# EAGLE design fzduino (EAGLE 5.11)
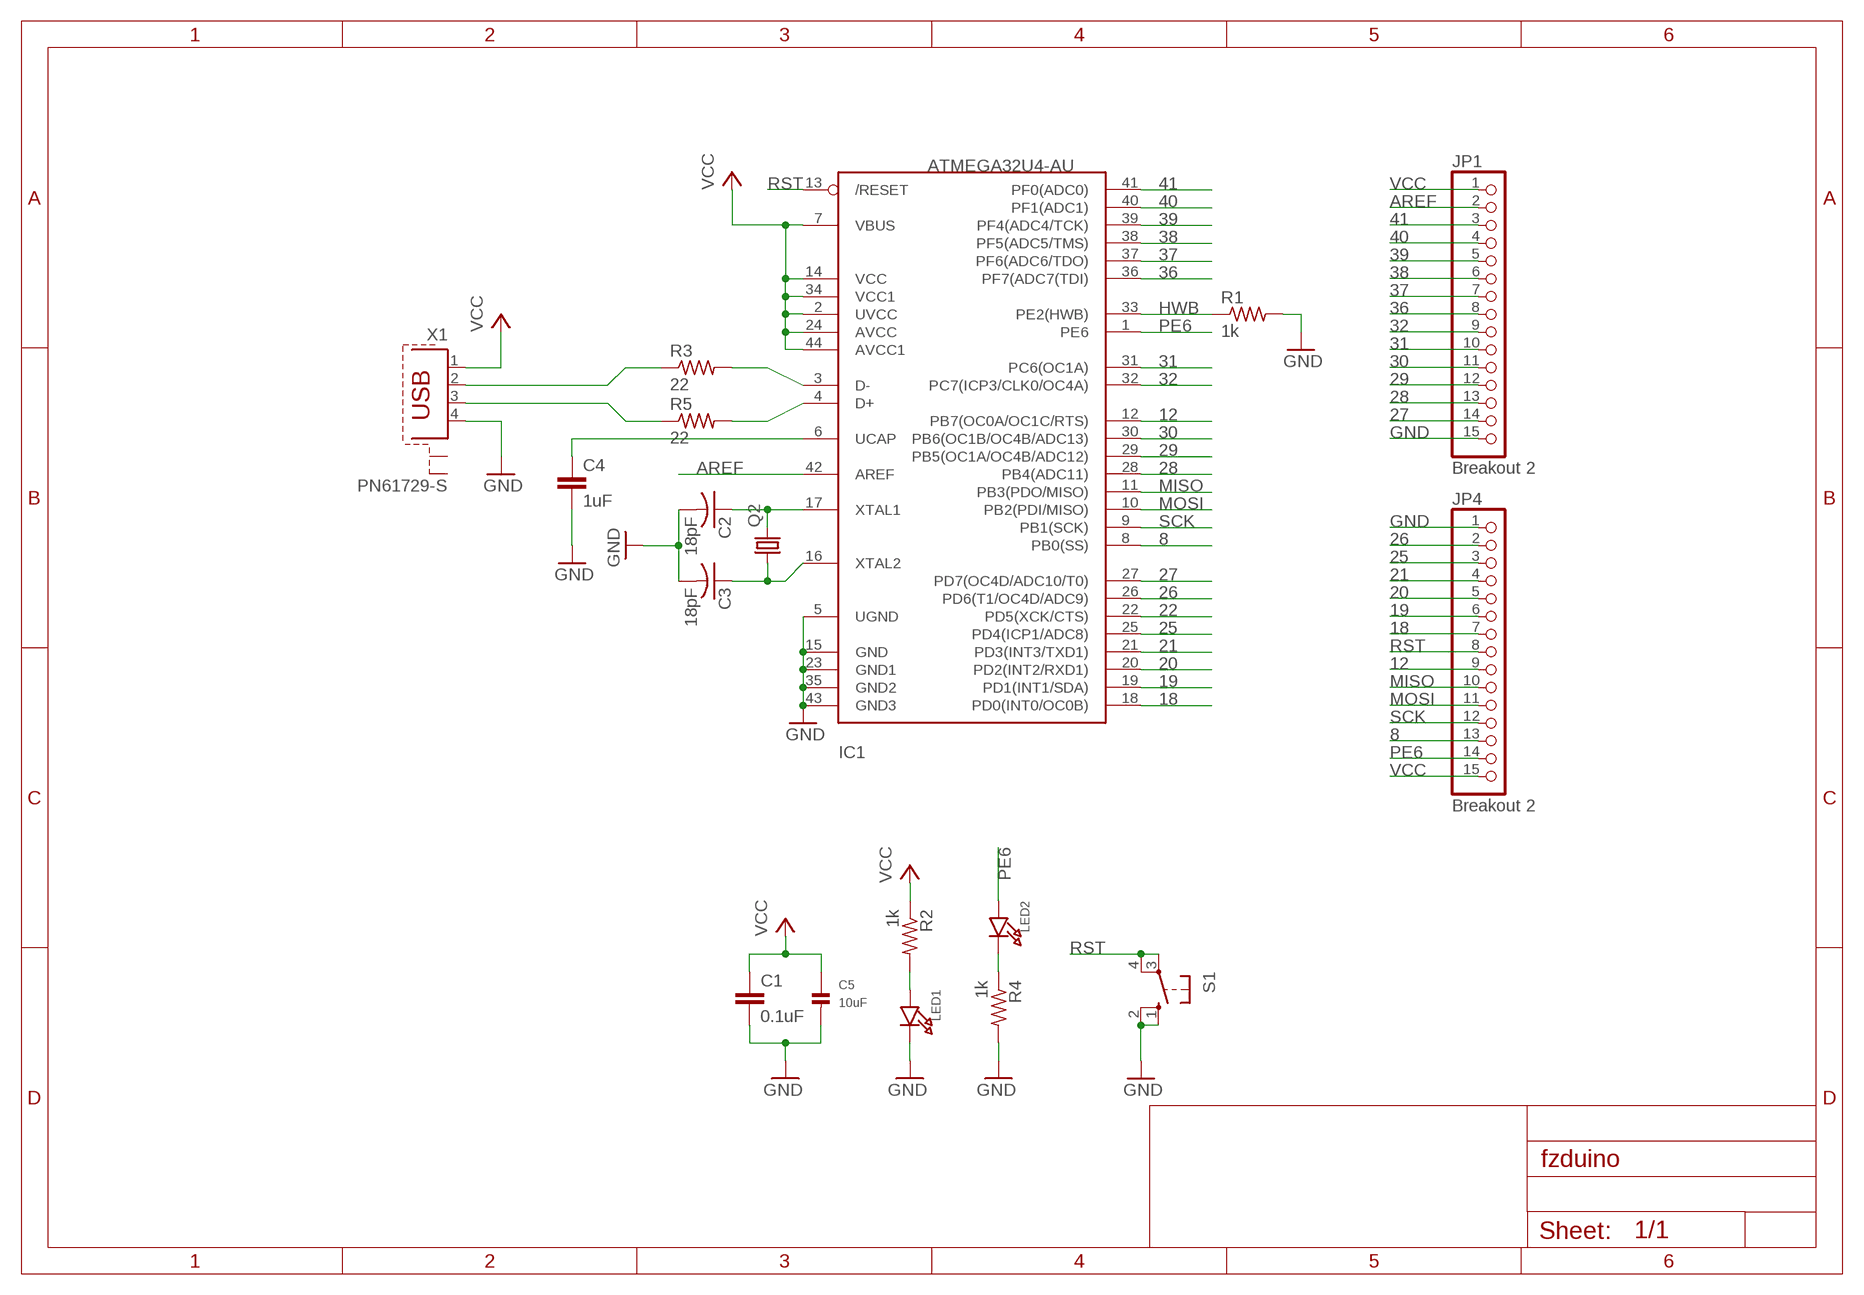
[diagram p0: schematic, sheet 1]

## Parts
C1  0.1uF  C-EUC0805  [C0805]
C2  18pF  C-USC0805K  [C0805K]
C3  18pF  C-USC0805K  [C0805K]
C4  1uF  C-EUC0805  [C0805]
C5  10uF  CAP_CERAMIC1206  [1206]
IC1  ATMEGA32U4-AU  [TQFP44]
JP1  Breakout 2  PINHD-1X15-CB  [1X15-CB]
JP4  Breakout 2  PINHD-1X15-CB  [1X15-CB]
LED1  LED1206  [CHIPLED_1206]
LED2  LED1206  [CHIPLED_1206]
Q2  CRYSTALHC49S  [HC49/S]
R1  1k  R-US_M1206  [M1206]
R2  1k  R-US_M1206  [M1206]
R3  22  R-US_M1206  [M1206]
R4  1k  R-US_M1206  [M1206]
R5  22  R-US_M1206  [M1206]
S1  10-XX  [B3F-10XX]
X1  PN61729-S  [PN61729-S]

## Nets
8: IC1.8(PB0(SS)) JP4.13
12: IC1.12(PB7(OC0A/OC1C/RTS)) JP4.9
18: IC1.18(PD0(INT0/OC0B)) JP4.7
19: IC1.19(PD1(INT1/SDA)) JP4.6
20: IC1.20(PD2(INT2/RXD1)) JP4.5
21: IC1.21(PD3(INT3/TXD1)) JP4.4
22: IC1.22(PD5(XCK/CTS))
25: IC1.25(PD4(ICP1/ADC8)) JP4.3
26: IC1.26(PD6(T1/OC4D/ADC9)) JP4.2
27: IC1.27(PD7(OC4D/ADC10/T0)) JP1.14
28: IC1.28(PB4(ADC11)) JP1.13
29: IC1.29(PB5(OC1A/OC4B/ADC12)) JP1.12
30: IC1.30(PB6(OC1B/OC4B/ADC13)) JP1.11
31: IC1.31(PC6(OC1A)) JP1.10
32: IC1.32(PC7(ICP3/CLK0/OC4A)) JP1.9
36: IC1.36(PF7(ADC7(TDI)) JP1.8
37: IC1.37(PF6(ADC6/TDO)) JP1.7
38: IC1.38(PF5(ADC5/TMS)) JP1.6
39: IC1.39(PF4(ADC4/TCK)) JP1.5
40: IC1.40(PF1(ADC1)) JP1.4
41: IC1.41(PF0(ADC0)) JP1.3
AREF: IC1.42(AREF) JP1.2
GND: C1.2 C2.2 C3.2 C4.2 C5.2 IC1.5(UGND) IC1.15(GND) IC1.23(GND1) IC1.35(GND2) IC1.43(GND3) JP1.15 JP4.1 LED1.C R1.2 R4.2 S1.1(S) S1.2(S1) X1.4
HWB: IC1.33(PE2(HWB)) R1.1
MISO: IC1.11(PB3(PDO/MISO)) JP4.10
MOSI: IC1.10(PB2(PDI/MISO)) JP4.11
N$1: LED1.A R2.2
N$2: R5.1 X1.3
N$3: IC1.3(D-) R3.2
N$4: IC1.4(D+) R5.2
N$5: R3.1 X1.2
N$6: LED2.C R4.1
N$8: C2.1 IC1.17(XTAL1) Q2.2
N$9: C3.1 IC1.16(XTAL2) Q2.1
N$10: C4.1 IC1.6(UCAP)
PE6: IC1.1(PE6) JP4.14 LED2.A
RST: IC1.13(/RESET) JP4.8 S1.3(P) S1.4(P1)
SCK: IC1.9(PB1(SCK)) JP4.12
VCC: C1.1 C5.1 IC1.2(UVCC) IC1.7(VBUS) IC1.14(VCC) IC1.24(AVCC) IC1.34(VCC1) IC1.44(AVCC1) JP1.1 JP4.15 R2.1 X1.1
Unconnected: X1.S1 X1.S2

## Library data of the parts
C1 C4 = rcl:C-EU: CAPACITOR, European symbol
C2 C3 = adafruit:C-US: CAPACITOR, American symbol
C5 = microbuilder:CAP_CERAMIC: Ceramic Capacitors 0402 - 0402 Surface Mount Capacitors 16pF 50V 5% [Digikey: 445-4899-2-ND] 18pF 50V 5% [Digikey: 490-1281-2-ND] 22pF 50V 5% [Digikey: 490-1283-2-ND] 68pF 50V 5% [Digikey: 490-1289-2-ND] 0.1uF 10V 10% [Digikey: 490-1318-2-ND] 1.0uF 6.3V 10% [Digikey: 490-1320-2-ND] 0603 - 0603 Surface Mount Capacitors 16 pF 50V 5% [Digikey: 445-5051-2-ND] 22 pF 50V [Digikey: PCC220ACVTR-ND] 33 pF 50V 5% [Digikey: 490-1415-1-ND] 56pF 50V 5% [Digikey: 490-1421-1-ND] 220pF 50V 5% [Digikey: 445-1285-1-ND] 680 pF 50V 2200 pF 50V 5% C0G [Digikey: 445-1297-1-ND] 5600 pF 100V 5% X7R [Digikey: 478-3711-1-ND] 0.1 µF 25V 10% [Digikey: PCC2277TR-ND] 0.22 µF 16V 10% X7R [Digikey: 445-1318-1-ND] 1.0 µF 25V 10% [Digikey: 445-5146-2-ND] 0603 - RF Specific 3pF 250V +/-0.1pF RF [Digikey: 712-1347-1-ND] 18 pF 250V 5% [Digikey: 478-3505-1-ND or 712-1322-1-ND] 56 pF 250V 5% C0G RF [Digikey: 490-4867-1-ND] 68 pF 250V RF [Digikey: 490-4868-1-ND] 0805 - 0805 Surface Mount Capacitors 220 pF 250V 2% RF Ceramic Capacitor [Digikey: 712-1398-1-ND] 1000 pF 50V 2% NP0 Ceramic Capacitor [Digikey: 478-3760-1-ND] 0.1 µF 25V 10% Ceramic Capacitor [Digikey: PCC1828TR-ND] 1.0 µF 16V 10% Ceramic Capacitor[Digikey: 490-1691-2-ND] 10.0 µF 10V 10% Ceramic Capacitor[Digikey: 709-1228-1-ND] 10.0 uF 16V 10% Ceramic Capacitor [Digikey: 478-5165-2-ND] 47 uF 6.3V 20% Ceramic Capacitor [Digikey: 587-1779-1-ND or 399-5506-1-ND] 1206 - 1206 Surface Mount Capacitors 47uF 10V 20% Ceramic Capacitor [Digikey: 490-5528-1-ND or 399-5508-1-ND or 445-6010-1-ND]
IC1 = adaprog:ATMEGA32U4
JP1 JP4 = adafruit:PINHD-1X15: PIN HEADER
LED1 LED2 = microbuilder:LED: LED 0603 - 0603 Surface Mount Package 2mA: Green LED - Low Power (3.9mcd, 2ma, 1.7Vf) - Digikey: 475-2709-2-ND Orange LED - Low Power (9.8mcd, 2ma, 1.8Vf) - Digikey: 475-1194-2-ND Red LED - Low Power (5mcd, 2ma, 1.8Vf) - Digikey: 475-1195-2-ND Yellow LED - Low Power (7mcd, 2ma, 1.8Vf) - Digikey: 475-1196-2-ND 5mA: Blue LED - Low Power (17mcd, 5ma, 2.9Vf) - Digikey: LNJ937W8CRACT-ND 0805 - 0805 Surface Mount Package 2mA: Red LED (8.8mcd, 2mA, 1.8Vf, Clear) - Low Power [Digikey: 475-2510-1-ND] Green LED (5mcd, 2mA, 1.8Vf, Clear) - Low Power [Digikey: 475-2730-1-ND] Yellow LED (11.3mcd, 2mA, 1.8Vf, Clear) - Low Power [Digikey: 475-2555-1-ND] 20mA: Red LED (104mcd, 20mA, Diffused) - LS R976 [Digikey: 475-1278-6-ND] Red LED (12mcd, 20mA, 2.0Vf, Clear) - APT2012EC [Digikey: 754-1128-1-ND] Green LED (15mcd, 20mA, 2.2Vf, Clear) - APT2012GC [Digikey: 754-1131-1-ND] Orange LED (160mcd, 20mA, 2.1Vf, Clear) - APT2012SECK [Digikey: 754-1130-1-ND] 1206 - 1206 Surface Mount Package Green LED (26mcd, 20mA, Diffused) - LG N971 [Digikey: 475-1407-6-ND] Red LED (15mcd, 20mA, Diffused) - LH N974 [Digikey: 475-1416-6-ND]
Q2 = crystal:CRYSTAL: CRYSTAL; OC_FARNELL: 1667008; OC_NEWARK: unknown
R1-R5 = rcl:R-US_: RESISTOR, American symbol
S1 = switch-omron:10-XX: OMRON SWITCH; MPN: B3F-1000; OC_FARNELL: 176432; OC_NEWARK: 36M3542
X1 = con-berg:PN61729-S: BERG USB connector; OC_FARNELL: unknown; OC_NEWARK: unknown

## Board
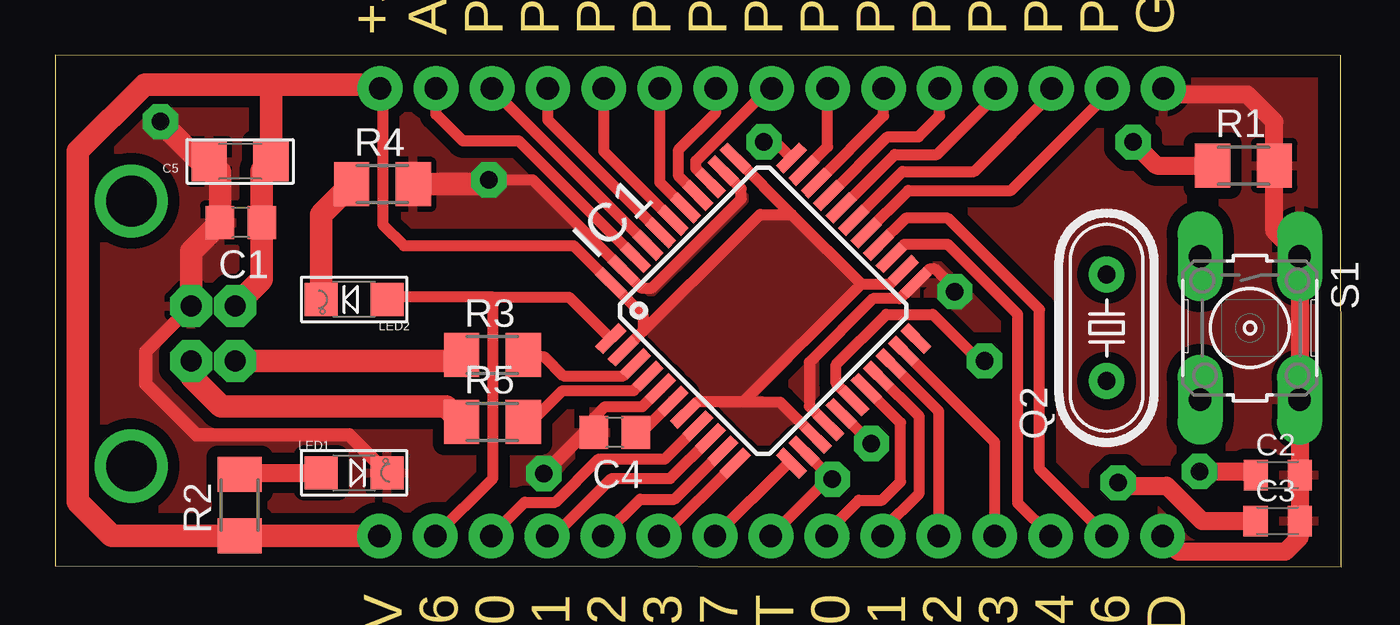
[diagram p1: board, top side]
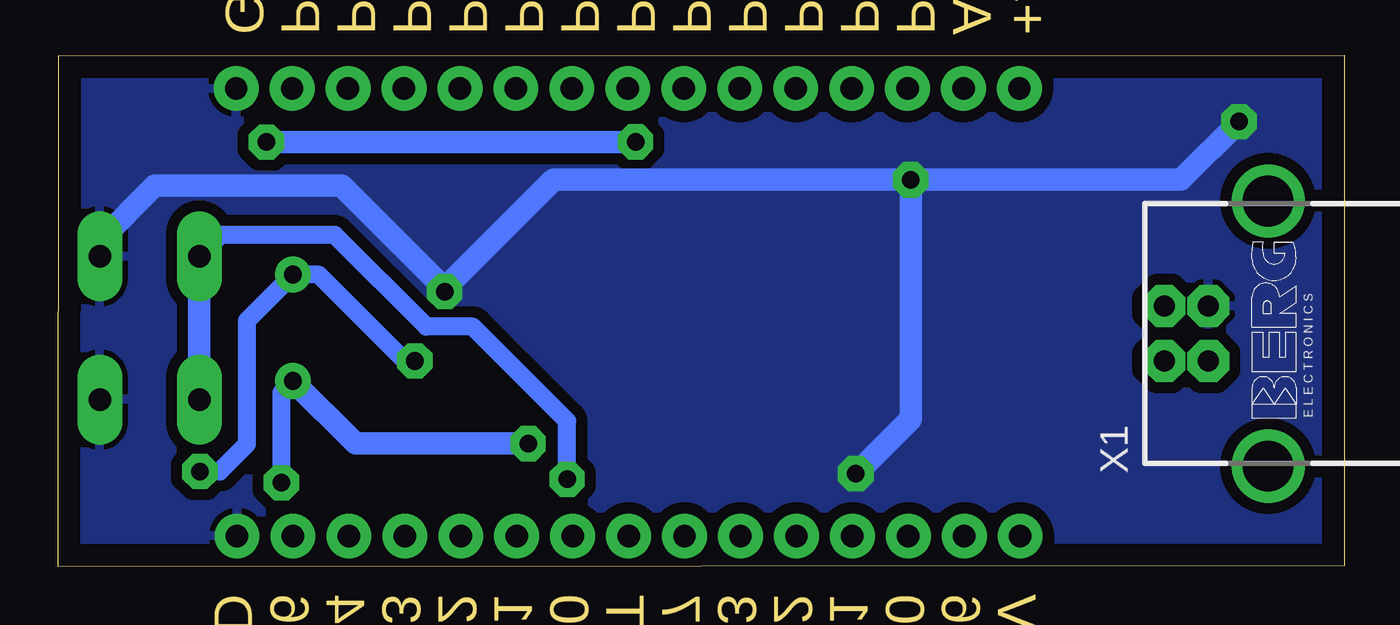
[diagram p2: board, bottom side, seen from below]

Size 58.39 x 23.25 mm. Coordinates in mm from the lower left corner, seen from the top.
Outline: 0,0.06 58.39,0 58.38,23.22 0.02,23.25 0,0.06
Copper layers (1*16): Top 0.035mm / dielectric 1.5mm / Bottom 0.035mm
Design rules "default *": minimum track width 10mil, minimum drill 24mil, track to track 20mil, track to pad 20mil, pad to pad 20mil, via to via 20mil, smd to smd 20mil, copper to edge 40mil, drill to drill 8mil, minimum pad ring 10mil, minimum via ring 8mil, stop-mask expansion 4mil, vias tented up to drill 0mil, thermal gap 10mil

### Footprints (pad centres in the part's own frame; a part is rotated, then mirrored left to right if it is on the bottom)
C0805 = smd 1.3 x 1.5: 1 -0.95,0; 2 0.95,0
C0805K = smd 1.1 x 1.4: 1 -1,0; 2 1,0
1206 = smd 1.6 x 1.8: 1 -1.4,0; 2 1.4,0
TQFP44 = smd 1.5 x 0.5: 1 -5.8,4; 2 -5.8,3.2; 3 -5.8,2.4; 4 -5.8,1.6; 5 -5.8,0.8; 6 -5.8,0; 7 -5.8,-0.8; 8 -5.8,-1.6; 9 -5.8,-2.4; 10 -5.8,-3.2; 11 -5.8,-4; 23 5.8,-4; 24 5.8,-3.2; 25 5.8,-2.4; 26 5.8,-1.6; 27 5.8,-0.8; 28 5.8,0; 29 5.8,0.8; 30 5.8,1.6; 31 5.8,2.4; 32 5.8,3.2; 33 5.8,4 | smd 0.5 x 1.5: 12 -4,-5.8; 13 -3.2,-5.8; 14 -2.4,-5.8; 15 -1.6,-5.8; 16 -0.8,-5.8; 17 0,-5.8; 18 0.8,-5.8; 19 1.6,-5.8; 20 2.4,-5.8; 21 3.2,-5.8; 22 4,-5.8; 34 4,5.8; 35 3.2,5.8; 36 2.4,5.8; 37 1.6,5.8; 38 0.8,5.8; 39 0,5.8; 40 -0.8,5.8; 41 -1.6,5.8; 42 -2.4,5.8; 43 -3.2,5.8; 44 -4,5.8
1X15-CB = drill 1.016 pad 1.778 round: 1 -17.78,0; 2 -15.24,0; 3 -12.7,0; 4 -10.16,0; 5 -7.62,0; 6 -5.08,0; 7 -2.54,0; 8 0,0; 9 2.54,0; 10 5.08,0; 11 7.62,0; 12 10.16,0; 13 12.7,0; 14 15.24,0; 15 17.78,0
CHIPLED_1206 = smd 1.5 x 1.5: A 0,-1.496; C 0,1.496
HC49/S = drill 0.813 round: 1 -2.413,0; 2 2.413,0
M1206 = smd 1.6 x 2: 1 -1.4,0; 2 1.4,0
B3F-10XX = drill 1.016 long: 1 -3.251,2.261; 2 3.251,2.261; 3 -3.251,-2.261; 4 3.251,-2.261
PN61729-S = drill 0.95 octagon: 1 1.25,4.71; 2 -1.25,4.71; 3 -1.25,2.71; 4 1.25,2.71 | drill 2.3 pad 2.9 round: S1 -6.02,0; S2 6.02,0

### Placement (x,y rotation side)
C1  8.44,15.64 180 top
C2  55.51,4.17 0 top
C3  55.5,2.08 0 top
C4  25.42,6.11 180 top
C5  8.4,18.42 180 top
IC1  32.16,11.64 45 top
JP1  32.53,21.73 0 top
JP4  32.5,1.4 180 top
LED1  13.58,4.27 270 top
LED2  13.58,12.15 90 top
Q2  47.74,10.86 90 top
R1  53.96,18.23 0 top
R2  8.38,2.81 90 top
R3  19.86,9.62 0 top
R4  14.86,17.39 0 top
R5  19.86,6.59 0 top
S1  54.24,10.85 270 top
X1  3.46,10.6 90 bottom

### Tracks (layer width: path | path; a pad name or v marks a point on that pad's centre or on a via)
8
  Top 0.508: IC1.8 27.68,4.91 24.68,4.91 22.71,2.94 21.32,2.94 19.8,1.42 JP4.13
12
  Top 0.508: IC1.12 33.27,4.71 JP4.9
18
  Top 0.508: IC1.18 38.39,6.54 38.39,3.87 37.54,3.03 36.49,3.03 35.04,1.57 JP4.7
19
  Top 0.508: IC1.19 39.23,6.83 39.23,3.35 37.58,1.7 JP4.6
20
  Top 0.508: IC1.20 40.12,7.07 JP4.5
21
  Top 0.508: IC1.21 42.66,5.66 JP4.4
25
  Top 0.508: IC1.25 38.56,14.65 40.53,14.65 43.71,11.47 43.71,2.9 JP4.3
26
  Top 0.508: IC1.26 38.62,15.84 40.53,15.84 44.69,11.68 44.69,4.45 JP4.2
27
  Top 0.508: IC1.27 38.74,17.09 43.4,17.09 47.77,21.46 JP1.14
28
  Top 0.508: IC1.28 38.48,17.97 41.74,17.97 45.23,21.46 JP1.13
29
  Top 0.508: IC1.29 38.12,18.74 40.04,18.74 42.69,21.39 JP1.12
30
  Top 0.508: IC1.30 37.79,19.54 39.21,19.54 40.15,20.49 JP1.11
31
  Top 0.508: IC1.31 37.61,20.49 JP1.10
32
  Top 0.508: IC1.32 35.07,19.09 JP1.9
36
  Top 0.508: IC1.36 29.09,18.1 29.09,18.44 32.38,21.73 JP1.8
37
  Top 0.508: IC1.37 28.31,17.75 28.31,18.96 29.99,20.64 JP1.7
38
  Top 0.508: IC1.38 27.45,17.48 JP1.6
39
  Top 0.508: IC1.39 24.91,18.88 24.91,18.89 JP1.5
40
  Top 0.508: IC1.40 22.37,20.29 22.37,20.3 JP1.4
41
  Top 0.508: IC1.41 19.83,21.7 JP1.3
AREF
  Top 0.508: IC1.42 21.06,19.34 18.52,19.34 17.29,20.56 JP1.2
GND  (via drill 0.8)
  Top 0.508: IC1.35 31.14,17.18 31.14,16.71 27.11,12.68 26.59,12.68 IC1.43 21.69,17.58 v19.69,17.58 | IC1.15 34.24,7.29 34.24,9.29 37.13,12.18 38.36,12.18 IC1.23 39.69,13.52 39.96,13.52 40.85,12.63 v40.85,12.5 | IC1.5 26.66,7.28 24.97,7.28 24.47,6.77 C4.2
  Top 0.61: C4.2 24.06,6.11 v22.19,4.23 | LED1.C 13.35,6 6.43,6 4.11,8.31 4.11,9.79 X1.4
  Top 0.813: JP4.1 50.99,0.69 55.86,0.69 56.5,1.34 C3.2 C2.2 S1.2 S1.1 55.36,15.25 R1.2 55.36,20.22 54.11,21.46 50.58,21.46 JP1.15
  Top 1.016: 5.97,11.85 X1.4 6.17,14.33 C1.2 7.49,17.93 | v19.69,17.58 19.49,17.39 R4.2 | 7.49,17.93 C5.2 | 7.49,17.93 7.08,17.93 v4.78,20.23
  Bottom 1.016: S1.1 56.5,14.81 54,17.31 45.52,17.31 40.85,12.63 | 40.85,12.63 v40.85,12.5 | v22.19,4.23 19.69,6.73 v19.69,17.58 | 40.85,12.63 35.9,17.58 v19.69,17.58 | v4.78,20.23 7.42,17.58 v19.69,17.58
  pour Bottom: -0.06,23.29 58.36,23.29 58.42,0.03 0,0.03
  pour Top: 0.07,23.25 58.49,23.25 58.42,0.03 0,0.03
HWB  (via drill 0.8)
  Top 0.508: IC1.33 32.69,19.3 v32.18,19.3
  Top 0.813: R1.1 50,18.23 49.3,18.93 49.3,18.94 v48.94,19.3
  Bottom 0.508: v48.94,19.3
  Bottom 1.016: v32.18,19.3 v32.19,19.3 v48.94,19.3
MISO
  Top 0.508: IC1.11 27.57,1.4 JP4.10
MOSI
  Top 0.508: IC1.10 28.12,3.08 26.56,3.08 24.89,1.4 JP4.11
N$1
  Top 0.813: R2.2 8.44,4.27 LED1.A
N$2
  Top 1.016: R5.1 17.76,7.29 7.53,7.29 6.17,8.65 X1.3
N$3
  Top 0.508: IC1.3 25.8,8.68 23.06,8.68 22.2,9.55 20.75,9.55 20.82,9.62 R3.2
N$4
  Top 0.508: IC1.4 26.27,8.01 23.04,8.01 21.62,6.59 R5.2
N$5
  Top 1.016: X1.2 18.19,9.35 R3.1
N$6
  Top 1.016: LED2.C 12.08,16.01 R4.1
N$8  (via drill 0.8)
  Top 0.508: IC1.17 35.45,8.34 35.45,9.19 37.73,11.47 39.85,11.47 41.96,9.36 v42.2,9.36
  Top 0.813: v51.96,4.34 54.35,4.34 C2.1
  Bottom 0.813: v42.2,9.36 42.65,9.36 46.57,13.28 Q2.2 47.74,13.26 49.83,11.17 49.83,5.57 51.06,4.34 v51.96,4.34
N$9  (via drill 0.8)
  Top 0.508: IC1.16 v37.06,5.6
  Top 0.813: C3.1 52.07,2.08 50.47,3.68 48.4,3.68 v48.27,3.82
  Bottom 0.813: Q2.1 48.27,7.92 v48.27,3.82
  Bottom 1.016: v48.27,3.82 48.16,3.93 | v37.06,5.6 44.89,5.6 Q2.1
N$10
  Top 0.508: IC1.6 26.62,6.11 C4.1
PE6
  Top 0.508: IC1.1 23.33,12.25 19.88,12.25 | LED2.A 15.17,12.25 19.88,12.25 | JP4.14 19.88,4.03 19.88,12.25
RST  (via drill 0.8)
  Top 0.508: IC1.13 v35.29,3.98 35.08,3.98 JP4.8
  Bottom 0.813: v35.29,3.98 35.29,6.63 39.57,10.91 41.68,10.91 45.84,15.08 51.01,15.08 S1.3
  Bottom 1.016: S1.3 S1.4
SCK
  Top 0.508: IC1.9 27.92,4.01 25.27,4.01 22.66,1.4 JP4.12
VCC
  Top 0.508: R2.1 8.59,1.4 | IC1.24 37.9,12.85 36.6,12.85 | 33.44,16.01 36.6,12.85 | 33.44,16.01 IC1.34 | IC1.7 29.13,7.49 31.23,7.49 | 31.23,7.49 32.91,7.49 IC1.14 | 36.6,12.85 31.23,7.49 | 33.44,16.01 32,16.01 IC1.2 26.7,10.71 26.7,11.44 IC1.44 23.55,14.59 15.84,14.59 14.87,15.55 14.87,21.61 JP1.1
  Top 1.016: JP4.15 8.59,1.4 2.58,1.4 1.03,2.95 1.03,18.88 4.06,21.91 9.68,21.91 | 9.68,21.91 9.8,21.79 C5.1 9.39,18 C1.1 9.39,13.06 X1.1 | 9.68,21.91 14.57,21.91 JP1.1
  pour Top: 32.38,15.91 33.33,15.91 36.19,13.05 36.19,12.41 31.43,7.65 33.02,7.33 33.65,6.7 32.38,5.75 31.75,5.75 26.98,10.51

### Text on the board
Dimension: +5V | AREF | PF0 | PF1 | PF4 | PF5 | PF6 | PF7 | PC7 | PC6 | PB6 | PB5 | PB4 | PD7 | GND | +5V | PE6 | PB0 | PB1 | PB2 | PB3 | PB7 | RESET | PD0 | PD1 | PD2 | PD3 | PD4 | PD6 | GND